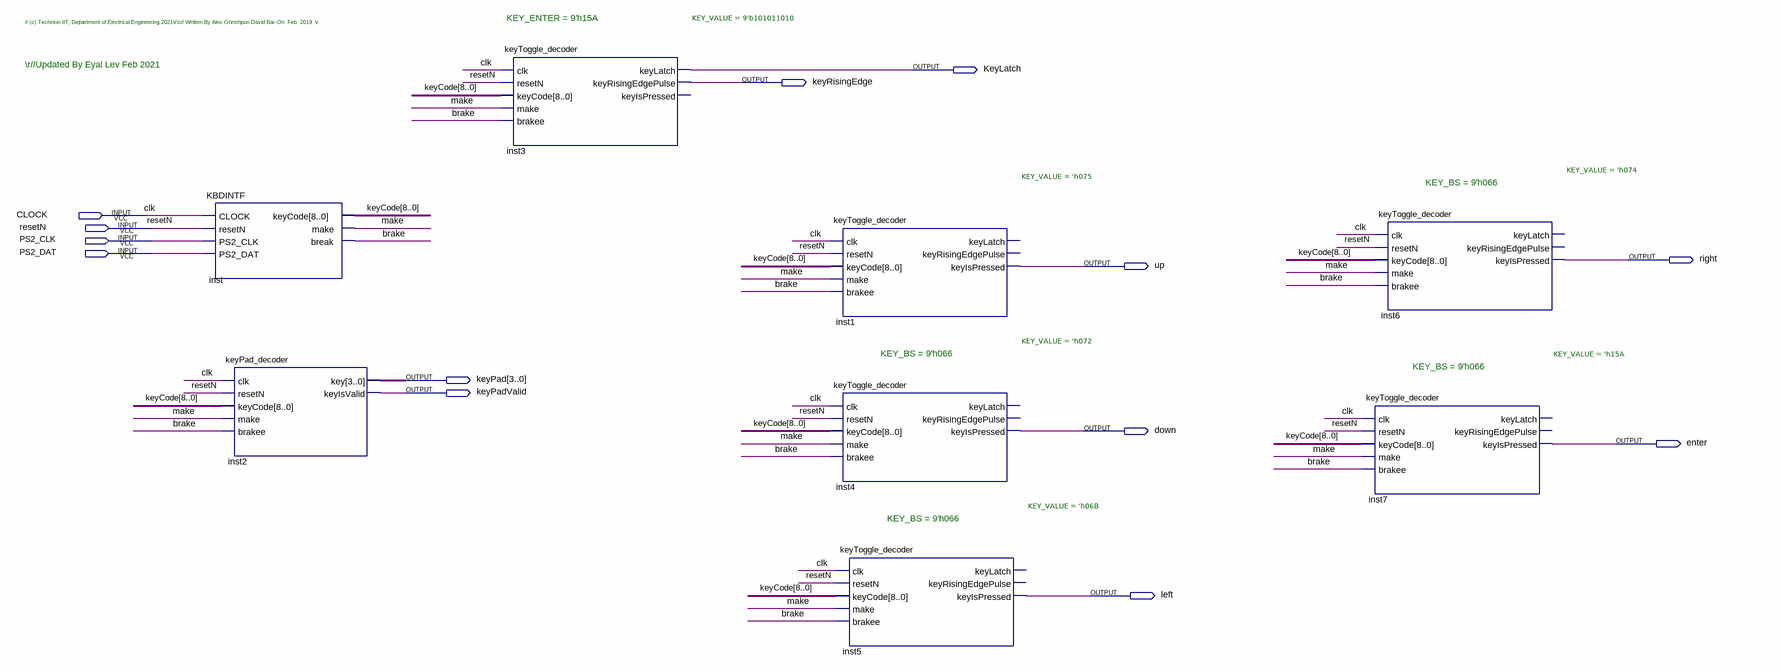
[diagram p0: schematic sheet]
// Quartus schematic KEYBOARD_INTERFACE.bdf as structural Verilog: 8 symbols, 13 pins
module KEYBOARD_INTERFACE (
  input  CLOCK,
  input  resetN,
  input  PS2_CLK,
  input  PS2_DAT,
  output KeyLatch,
  output keyRisingEdge,
  output right,
  output up,
  output [3:0] keyPad,
  output keyPadValid,
  output down,
  output enter,
  output left
);

  wire brake, make;
  wire [8:0] keyCode;

  KBDINTF inst (
    .CLOCK(CLOCK), .resetN(resetN), .PS2_CLK(PS2_CLK), .PS2_DAT(PS2_DAT), .keyCode(keyCode), .make(make),
    .\break (brake));
  keyPad_decoder inst2 (
    .clk(CLOCK), .resetN(resetN), .keyCode(keyCode), .make(make), .brakee(brake), .key(keyPad),
    .keyIsValid(keyPadValid));
  keyToggle_decoder #(.KEY_VALUE(9'b101011010)) inst3 (
    .clk(CLOCK), .resetN(resetN), .keyCode(keyCode), .make(make), .brakee(brake), .keyLatch(KeyLatch),
    .keyRisingEdgePulse(keyRisingEdge));  // open: keyIsPressed
  keyToggle_decoder #(.KEY_VALUE('h075)) inst1 (
    .clk(CLOCK), .resetN(resetN), .keyCode(keyCode), .make(make), .brakee(brake), .keyIsPressed(up));  // open: keyLatch, keyRisingEdgePulse
  keyToggle_decoder #(.KEY_VALUE('h072)) inst4 (
    .clk(CLOCK), .resetN(resetN), .keyCode(keyCode), .make(make), .brakee(brake), .keyIsPressed(down));  // open: keyLatch, keyRisingEdgePulse
  keyToggle_decoder #(.KEY_VALUE('h06B)) inst5 (
    .clk(CLOCK), .resetN(resetN), .keyCode(keyCode), .make(make), .brakee(brake), .keyIsPressed(left));  // open: keyLatch, keyRisingEdgePulse
  keyToggle_decoder #(.KEY_VALUE('h074)) inst6 (
    .clk(CLOCK), .resetN(resetN), .keyCode(keyCode), .make(make), .brakee(brake), .keyIsPressed(right));  // open: keyLatch, keyRisingEdgePulse
  keyToggle_decoder #(.KEY_VALUE('h15A)) inst7 (
    .clk(CLOCK), .resetN(resetN), .keyCode(keyCode), .make(make), .brakee(brake), .keyIsPressed(enter));  // open: keyLatch, keyRisingEdgePulse

  // Other names for the same wires on the sheet: clk = CLOCK

  // Notes on the sheet:
  //   KEY_ENTER = 9'h15A
  //   // (c) Technion IIT, Department of Electrical Engineering 2021\r\n// Written By Alex Grinshpun David Bar-On  Feb  2019  \r
  //   \r//Updated By Eyal Lev Feb 2021
  //   KEY_BS = 9'h066
  //   KEY_BS = 9'h066
  //   KEY_BS = 9'h066
  //   KEY_BS = 9'h066
endmodule
